# EAGLE design display (EAGLE 4.16)
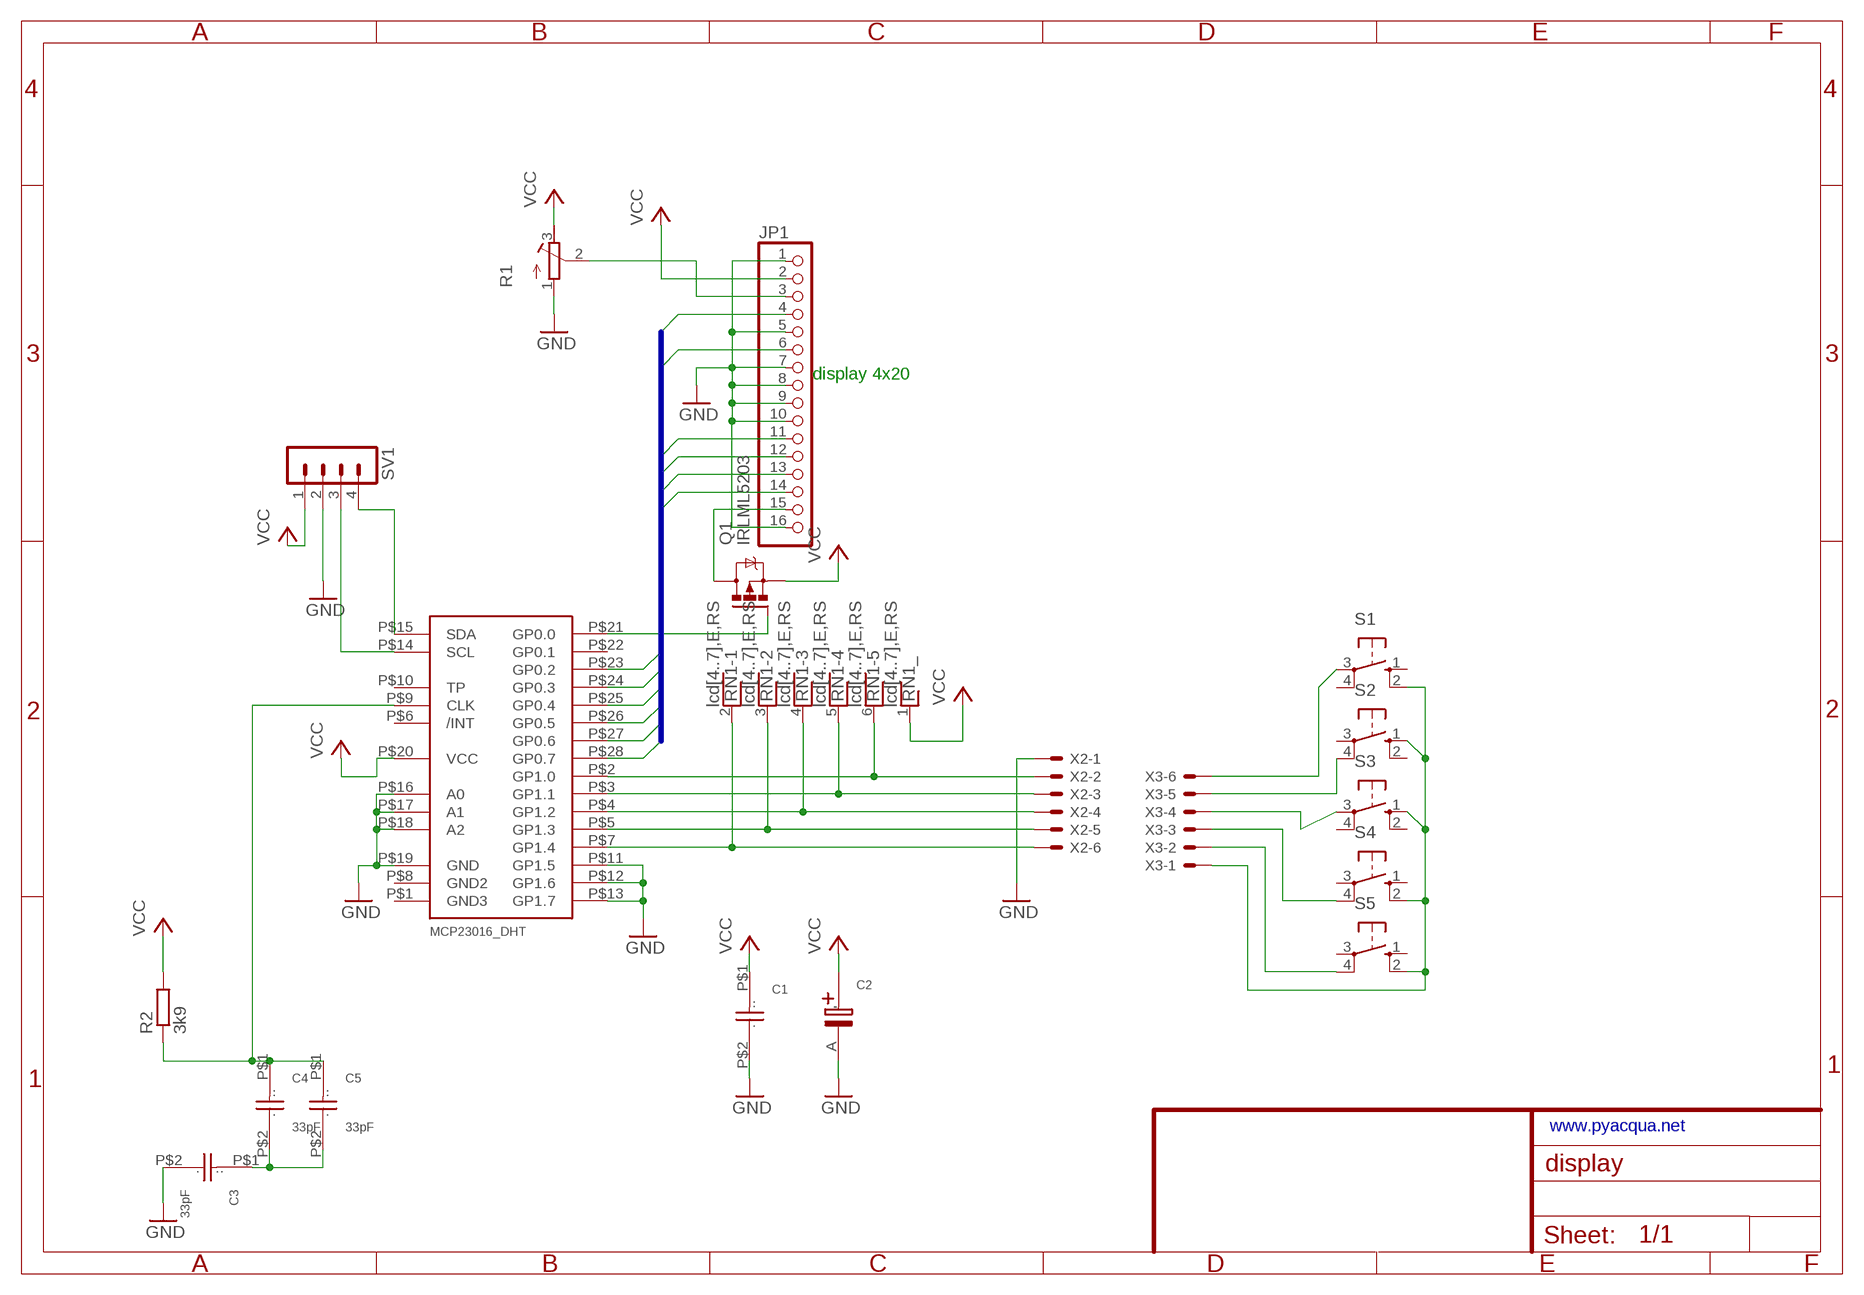
[diagram p0: schematic, sheet 1]

## Parts
C1  CAP_POLI  [CAP_POLI]
C2  CAP_ELET  [CAP_ELET]
C3  33pF  CAP_POLI  [CAP_POLI]
C4  33pF  CAP_POLI  [CAP_POLI]
C5  33pF  CAP_POLI  [CAP_POLI]
JP1  PINHD-1X16  [1X16]
Q1  IRLML5203  [MICRO3]
R1  R-TRIMM4G/J  [RTRIM4G/J]
R2  3k9  R-EU_0207/2V  [0207/2V]
RN1  lcd[4..7],E,RS  RNX5  [RN-6]
S1  10-XX  [B3F-10XX]
S2  10-XX  [B3F-10XX]
S3  10-XX  [B3F-10XX]
S4  10-XX  [B3F-10XX]
S5  10-XX  [B3F-10XX]
SV1  MA04-1  [MA04-1]
U$1  MCP23016_DHT  [MCP23016_DHT]
X2  22-23-2061  [22-23-2061]
X3  22-23-2061  [22-23-2061]

## Nets
D4: JP1.11 U$1.P$25(GP0.4)
D5: JP1.12 U$1.P$26(GP0.5)
D6: JP1.13 U$1.P$27(GP0.6)
D7: JP1.14 U$1.P$28(GP0.7)
E: JP1.6 U$1.P$24(GP0.3)
GND: C1.P$2(..) C2.A(') C3.P$2(..) JP1.1 JP1.5 JP1.7 JP1.8 JP1.9 JP1.10 JP1.16 R1.1(E) SV1.2 U$1.P$11(GP1.5) U$1.P$12(GP1.6) U$1.P$13(GP1.7) U$1.P$16(A0) U$1.P$17(A1) U$1.P$18(A2) U$1.P$19(GND) X2.1
N$1: S1.2(S1) S2.1(S) S3.1(S) S4.2(S1) S5.2(S1) X3.1
N$2: SV1.4 U$1.P$15(SDA)
N$3: SV1.3 U$1.P$14(SCL)
N$4: Q1.1(G) U$1.P$21(GP0.0)
N$5: S5.4(P1) X3.2
N$6: S4.4(P1) X3.3
N$7: S3.3(P) X3.4
N$8: S2.4(P1) X3.5
N$9: S1.3(P) X3.6
N$10: JP1.3 R1.2(S)
N$11: JP1.15 Q1.3(D)
N$12: C4.P$1(.) C5.P$1(.) R2.1 U$1.P$9(CLK)
N$13: C3.P$1(.) C4.P$2(..) C5.P$2(..)
N$23: RN1.6 U$1.P$2(GP1.0) X2.2
N$30: RN1.5 U$1.P$3(GP1.1) X2.3
N$44: RN1.4 U$1.P$4(GP1.2) X2.4
N$45: RN1.3 U$1.P$5(GP1.3) X2.5
N$46: RN1.2 U$1.P$7(GP1.4) X2.6
RS: JP1.4 U$1.P$23(GP0.2)
VCC: C1.P$1(.) C2.B(.) JP1.2 Q1.2(S) R1.3(A) R2.2 RN1.1 SV1.1 U$1.P$20(VCC)
Unconnected: S1.1(S) S1.4(P1) S2.2(S1) S2.3(P) S3.2(S1) S3.4(P1) S4.1(S) S4.3(P) S5.1(S) S5.3(P) U$1.P$6(/INT) U$1.P$10(TP) U$1.P$22(GP0.1)

## Buses
D[4..7],E,RS

## Notes on the sheet
- display 4x20
- www.pyacqua.net

## Power pins joined to a net without a drawn wire
GND2: U$1.P$8(GND2)
GND3: U$1.P$1(GND3)

## Library data of the parts
C1 C3-C5 = aggiunte:CAP_POLI: Condensatore non elett passo 5.08 mm (2 x 2.54)
C2 = aggiunte:CAP_ELET: Condensatore elett. passo 2.54 mm
JP1 = pinhead:PINHD-1X16: PIN HEADER
Q1 = transistor-power:IRLML5203: HEXFET P-Channel Power MOSFET
R1 = rcl:R-TRIMM: Trimm resistor
R2 = rcl:R-EU_: RESISTOR, European symbol
RN1 = resistor-net:RNX5: RESISTOR NETWORK
S1-S5 = switch-omron:10-XX: OMRON SWITCH
SV1 = con-lstb:MA04-1: PIN HEADER
U$1 = aggiunte:MCP23016_DHT: MCP23016 I2C expander a 16 bit
X2 X3 = con-molex:22-23-2061: .100" (2.54mm) Center Header - 6 Pin

## Net classes
0 default: width 0.762 mm

## Board
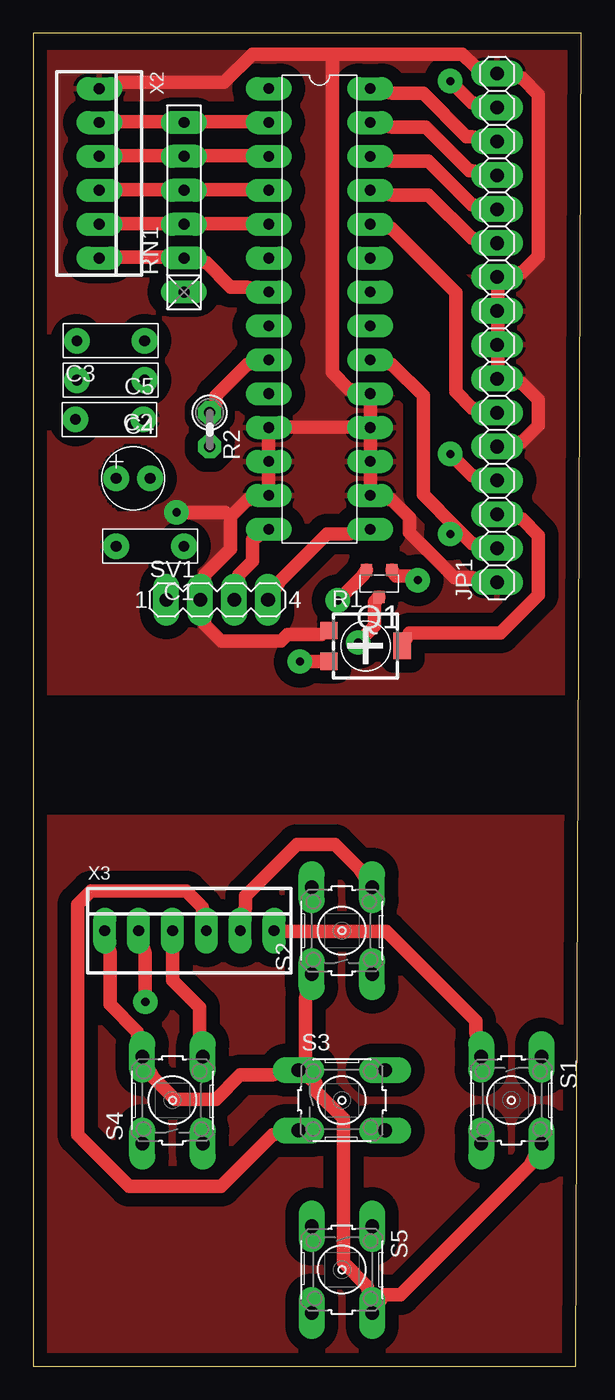
[diagram p1: board, top side]
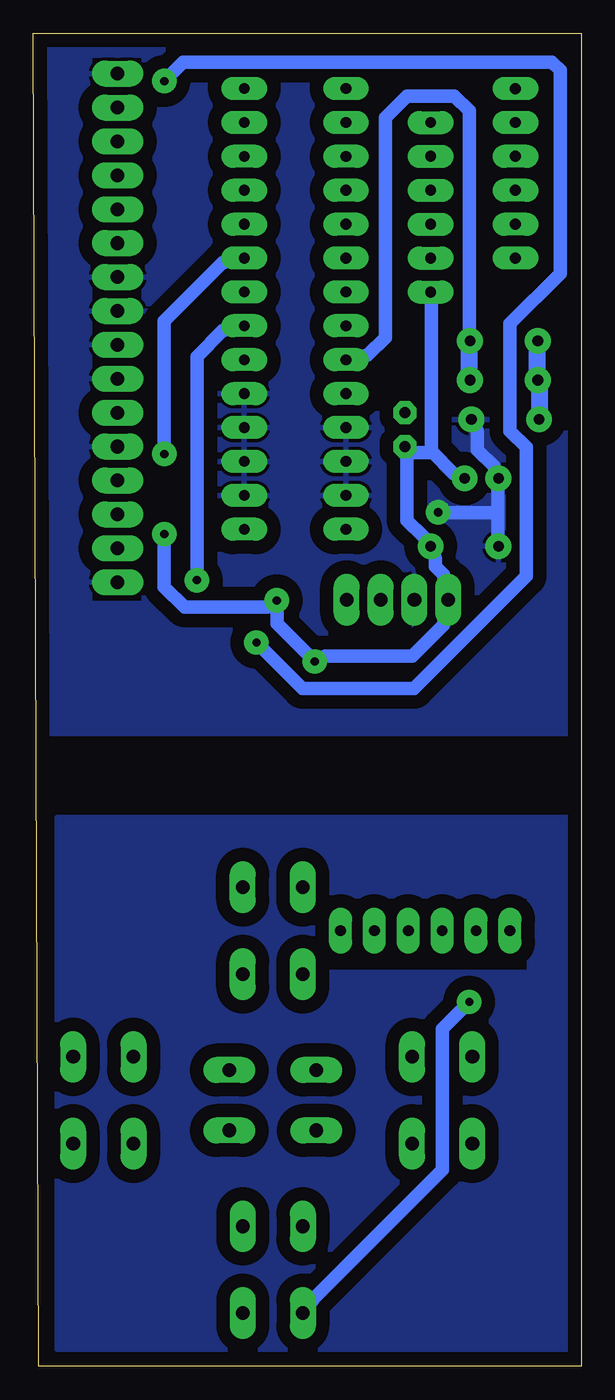
[diagram p2: board, bottom side, seen from below]

Size 41.07 x 99.85 mm. Coordinates in mm from the lower left corner, seen from the top.
Outline: 0,99.85 0,0 40.67,0 41.07,99.85 0,99.85
Copper layers (1*16): Top 0.035mm / dielectric 1.5mm / Bottom 0.035mm
Design rules "mio2": minimum track width 40mil, minimum drill 24mil, track to track 40mil, track to pad 40mil, pad to pad 40mil, via to via 40mil, smd to smd 24mil, copper to edge 40mil, drill to drill 8mil, minimum pad ring 18mil, minimum via ring 24mil, stop-mask expansion 4mil, vias tented up to drill 0mil, thermal gap 10mil
bRestrict: area 4.1,29.7 to 19.2,35; area 33,57.4 to 36.6,98; area 2.1,82.2 to 7,96.8

### Footprints (pad centres in the part's own frame; a part is rotated, then mirrored left to right if it is on the bottom)
CAP_POLI = drill 0.8 pad 1.93 round: P$1 -5.08,0; P$2 0,0
CAP_ELET = drill 0.8 pad 1.93 round: A -2.54,0; B 0,0
1X16 = drill 1.016 long: 1 -19.05,0; 2 -16.51,0; 3 -13.97,0; 4 -11.43,0; 5 -8.89,0; 6 -6.35,0; 7 -3.81,0; 8 -1.27,0; 9 1.27,0; 10 3.81,0; 11 6.35,0; 12 8.89,0; 13 11.43,0; 14 13.97,0; 15 16.51,0; 16 19.05,0
MICRO3 = smd 0.8 x 0.9: 1 -0.95,-1; 2 0.95,-1; 3 0,1
RTRIM4G/J = smd 1.3 x 1.3: 1 -1.15,-2.75; 3 1.15,-2.75 | smd 2 x 1.3: 2 0,2.75
0207/2V = drill 0.813 octagon: 1 -1.27,0; 2 1.27,0
RN-6 = drill 0.813 long: 1 -6.35,0; 2 -3.81,0; 3 -1.27,0; 4 1.27,0; 5 3.81,0; 6 6.35,0
B3F-10XX = drill 1.016 long: 1 -3.251,2.261; 2 3.251,2.261; 3 -3.251,-2.261; 4 3.251,-2.261
MA04-1 = drill 1.016 long: 1 -3.81,0; 2 -1.27,0; 3 1.27,0; 4 3.81,0
MCP23016_DHT = drill 0.8 long: P$1 0,0; P$2 2.54,0; P$3 5.08,0; P$4 7.62,0; P$5 10.16,0; P$6 12.7,0; P$7 15.24,0; P$8 17.78,0; P$9 20.32,0; P$10 22.86,0; P$11 25.4,0; P$12 27.94,0; P$13 30.48,0; P$14 33.02,0; P$15 33.02,7.62; P$16 30.48,7.62; P$17 27.94,7.62; P$18 25.4,7.62; P$19 22.86,7.62; P$20 20.32,7.62; P$21 17.78,7.62; P$22 15.24,7.62; P$23 12.7,7.62; P$24 10.16,7.62; P$25 7.62,7.62; P$26 5.08,7.62; P$27 2.54,7.62; P$28 0,7.62
22-23-2061 = drill 0.813 long: 1 -6.35,0; 2 -3.81,0; 3 -1.27,0; 4 1.27,0; 5 3.81,0; 6 6.35,0

### Placement (x,y rotation side)
C1  6.21,61.43 180 top
C2  8.75,66.51 0 top
C3  8.24,70.93 0 top
C4  3.26,73.87 180 top
C5  3.26,76.82 180 top
JP1  34.76,77.79 90 top
Q1  25.92,58.63 180 top
R1  24.9,53.96 270 top
R2  13.22,70.17 270 top
RN1  11.29,86.83 90 top
S1  35.83,19.92 270 top
S2  23.13,32.62 90 top
S3  23.13,19.92 0 top
S4  10.43,19.92 90 top
S5  23.13,7.22 270 top
SV1  13.78,57.41 0 top
U$1  17.64,95.72 270 top
U$2  [A4P-LOC]  -8.47,-6.44 0 top  (outside the outline)
X2  4.94,89.37 270 top
X3  11.7,32.62 0 top

### Tracks (layer width: path | path; a pad name or v marks a point on that pad's centre or on a via)
D4
  Top 1.016: U$1.P$25 26.89,87.74 29.63,87.74 32.88,84.49 JP1.11
D5
  Top 1.016: U$1.P$26 26.89,90.28 29.63,90.28 32.88,87.03 JP1.12
D6
  Top 1.016: U$1.P$27 26.89,92.82 29.43,92.82 32.68,89.57 32.88,89.57 JP1.13
D7
  Top 1.016: U$1.P$28 26.89,95.36 29.22,95.36 32.47,92.11 32.88,92.11 JP1.14
E
  Top 1.016: U$1.P$24 26.89,85.2 31.66,80.43 31.66,73.01 32.88,71.79 JP1.6
GND  (via drill 0.61)
  Top 0.813: U$1.P$19 25.26,73.01
  Top 1.016: U$1.P$18 U$1.P$19 23.63,73.21 22.42,74.43 22.42,98.31 | U$1.P$18 U$1.P$17 U$1.P$16 26.89,64.88 28.21,63.56 28.21,62.44 31.56,59.09 32.88,59.09 JP1.1 | R1.1 21.6,54.82 19.06,54.82 18.55,54.32 14.08,54.32 12.87,55.53 SV1.2 12.87,59.29 14.8,61.22 14.8,63.66 | 14.8,63.66 16.01,64.88 U$1.P$13 U$1.P$12 U$1.P$11 19.27,70.37 23.63,70.37 U$1.P$18 | v10.73,63.97 14.39,63.97 14.8,63.66 | JP1.5 36.64,69.25 37.86,70.47 37.86,72.4 36.64,73.62 JP1.7 34.81,74.84 34.81,75.65 JP1.8 34.81,77.38 34.81,78.19 JP1.9 34.81,79.92 34.81,80.73 JP1.10 36.64,81.95 37.86,83.17 37.86,95.26 36.64,96.48 JP1.16 33.08,97.39 32.17,98.31 22.42,98.31 | 22.42,98.31 16.42,98.31 14.29,96.17 6.57,96.17 X2.1
  Top 1.27: SV1.2 12.66,57.57
  Bottom 0.813: SV1.2 12.46,57.36
  Bottom 1.016: 6.26,63.97 6.26,65.59 C2.A 6.57,67.42 7.79,68.64 7.79,70.06 C3.P$2 | 6.26,63.97 6.26,62.34 C1.P$2 | 6.26,63.97 v10.73,63.97
  pour Bottom: 0.27,99.22 40.3,99.22 40.3,47.41 0.27,47.41
  pour Top: 0.67,98.41 40.5,98.41 40.5,50.45 0.67,50.45
N$1
  Top 1.016: S3.1 20.38,23.02 20.38,27.49 S2.1 | S3.1 17.95,21.8 15.51,21.8 13.68,19.97 10.63,19.97 9,21.6 S4.2 7.79,25.05 5.75,27.09 5.75,30.95 X3.1 | S1.2 37.25,15.1 27.5,5.34 26.28,5.34 S5.2 25.06,5.95 23.23,7.78 23.23,18.55 21.2,20.58 21.2,21.19 S3.1
N$2
  Top 1.016: U$1.P$15 23.63,62.34 22.01,62.34 18.45,58.79 SV1.4
N$3
  Top 0.813: 17.54,62.85 17.64,62.75 U$1.P$14
  Top 1.016: U$1.P$14 16.42,61.94 16.42,60.31 15.41,59.29 SV1.3
N$4  (via drill 0.61)
  Top 1.016: v28.82,58.89 28.51,59.19 27.19,59.19 Q1.1
  Bottom 1.016: v28.82,58.89 28.82,75.65 26.89,77.58 U$1.P$21
N$5  (via drill 0.61)
  Top 1.016: v8.39,27.29 8.39,30.95 X3.2
  Bottom 1.016: v8.39,27.29 10.43,25.26 10.43,14.69 19.98,5.14 S5.4
N$6
  Top 1.016: X3.3 10.43,28.92 12.46,26.88 12.46,23.43 12.69,23.2 S4.4
N$7
  Top 1.016: X3.4 12.66,34.4 11.44,35.62 4.33,35.62 3.31,34.61 3.31,17.33 7.18,13.47 14.08,13.47 17.95,17.33 S3.3
N$8
  Top 1.016: X3.5 15.91,34.4 15.91,35.21 19.77,39.08 22.62,39.08 24.45,37.25 S2.4
N$9
  Top 1.016: X3.6 18.76,32.57 26.48,32.57 33.19,25.87 33.19,25.05 S1.3
N$10
  Top 1.016: R1.2 28.21,54.93 35.01,54.93 37.86,57.77 37.86,62.24 36.64,63.46 JP1.3
N$11  (via drill 0.61)
  Top 1.016: v24.35,54.21 25.57,55.43 25.57,57.26 Q1.3 | v31.25,96.28 32.88,94.65 JP1.15
  Bottom 1.016: v24.35,54.21 20.89,50.76 12.56,50.76 4.13,59.19 4.13,68.84 5.35,70.06 5.35,78.09 1.59,81.85 1.59,97.09 2.2,97.7 29.83,97.7 v31.25,96.28
N$12
  Top 1.016: U$1.P$9 16.01,75.04 13.68,72.71 13.68,72.2 R2.1
  Bottom 0.813: C5.P$1 8.39,76.87
  Bottom 1.016: C5.P$1 8.39,77.68 8.39,94.04 9.51,95.16 13.07,95.16 14.69,93.53 14.69,77.07 16.01,75.75 U$1.P$9
  Bottom 1.27: C4.P$1 8.39,74.64 8.39,76.06 C5.P$1
N$13
  Bottom 1.27: C3.P$1 3.11,71.79 3.11,73.01 C4.P$2 3.31,74.64 3.31,76.06 C5.P$2
N$14
  pour Top: 0.47,41.11 40.3,41.11 40.3,0.06 0.47,0.06
N$15
  pour Bottom: 1.08,41.11 39.28,41.11 39.28,1.28 1.08,1.28
N$23
  Top 1.016: U$1.P$2 16.01,93.23 12.97,93.23 RN1.6 9.61,93.23 6.57,93.23 X2.2
N$30
  Top 1.016: U$1.P$3 16.01,90.69 12.97,90.69 RN1.5 9.61,90.69 6.57,90.69 X2.3
N$44
  Top 1.016: U$1.P$4 16.01,88.15 12.97,88.15 RN1.4 9.61,88.15 6.57,88.15 X2.4
N$45
  Top 1.016: U$1.P$5 16.01,85.61 12.97,85.61 RN1.3 9.61,85.61 6.57,85.61 X2.5
N$46
  Top 1.016: U$1.P$7 16.01,80.83 14.8,80.83 12.97,82.66 RN1.2 9.61,83.07 6.57,83.07 X2.6
RS  (via drill 0.61)
  Top 1.016: v31.25,68.34 32.88,66.71 JP1.4
  Bottom 1.016: v31.25,68.34 31.25,78.29 26.89,82.66 U$1.P$23
VCC  (via drill 0.61)
  Top 1.016: 31.71,62.8 32.88,61.63 JP1.2 | 31.71,62.8 29.22,65.29 29.22,72.71 26.89,75.04 U$1.P$20 | v22.82,57.36 24.65,59.19 Q1.2 | v19.98,52.79 21.6,52.79 R1.3 | v31.25,62.34 31.71,62.8
  Bottom 1.016: 8.8,66.91 C2.B 9.61,66.91 11.14,68.44 11.24,68.44 | 11.24,68.44 12.46,68.44 R2.2 13.07,68.13 13.07,63.36 11.85,62.14 C1.P$1 10.93,60.51 10.93,59.9 10.33,59.29 SV1.1 10.33,55.53 12.66,53.2 19.16,53.2 v19.98,52.79 22.82,55.64 v22.82,57.36 23.53,56.86 29.73,56.86 31.25,58.38 v31.25,62.34 | RN1.1 11.24,79.72 11.24,68.44

### Text on the board
bRestrict: PYACQUA | PYACQUA